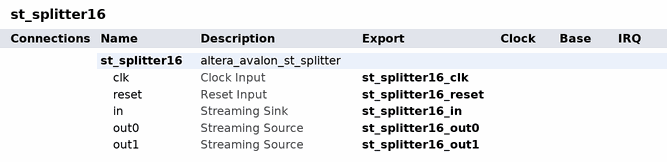
[diagram p0: system contents]
# Platform Designer (Qsys) system st_splitter16, MAX 10 10M50DAF484C6GES
# Parameters at their usual value, and those the tool derives, are not listed.
package require -exact qsys 19.1
create_system st_splitter16
set_project_property DEVICE_FAMILY {MAX 10}
set_project_property DEVICE 10M50DAF484C6GES

add_instance st_splitter16 altera_avalon_st_splitter 19.1
set_instance_parameter_value st_splitter16 BITS_PER_SYMBOL 8
set_instance_parameter_value st_splitter16 CHANNEL_WIDTH 1
set_instance_parameter_value st_splitter16 DATA_WIDTH 16
set_instance_parameter_value st_splitter16 ERROR_WIDTH 1
set_instance_parameter_value st_splitter16 MAX_CHANNELS 1
set_instance_parameter_value st_splitter16 NUMBER_OF_OUTPUTS 2
set_instance_parameter_value st_splitter16 QUALIFY_VALID_OUT 1
set_instance_parameter_value st_splitter16 READY_LATENCY 0
set_instance_parameter_value st_splitter16 USE_CHANNEL 0
set_instance_parameter_value st_splitter16 USE_DATA 1
set_instance_parameter_value st_splitter16 USE_ERROR 0
set_instance_parameter_value st_splitter16 USE_PACKETS 1
set_instance_parameter_value st_splitter16 USE_READY 1
set_instance_parameter_value st_splitter16 USE_VALID 1

# exported interfaces
add_interface st_splitter16_clk clock sink
set_interface_property st_splitter16_clk EXPORT_OF st_splitter16.clk
add_interface st_splitter16_in avalon_streaming sink
set_interface_property st_splitter16_in EXPORT_OF st_splitter16.in
add_interface st_splitter16_out0 avalon_streaming source
set_interface_property st_splitter16_out0 EXPORT_OF st_splitter16.out0
add_interface st_splitter16_out1 avalon_streaming source
set_interface_property st_splitter16_out1 EXPORT_OF st_splitter16.out1
add_interface st_splitter16_reset reset sink
set_interface_property st_splitter16_reset EXPORT_OF st_splitter16.reset

set_interconnect_requirement {$system} qsys_mm.clockCrossingAdapter HANDSHAKE
set_interconnect_requirement {$system} qsys_mm.enableEccProtection FALSE
set_interconnect_requirement {$system} qsys_mm.insertDefaultSlave FALSE
set_interconnect_requirement {$system} qsys_mm.maxAdditionalLatency 1

save_system st_splitter16.qsys
